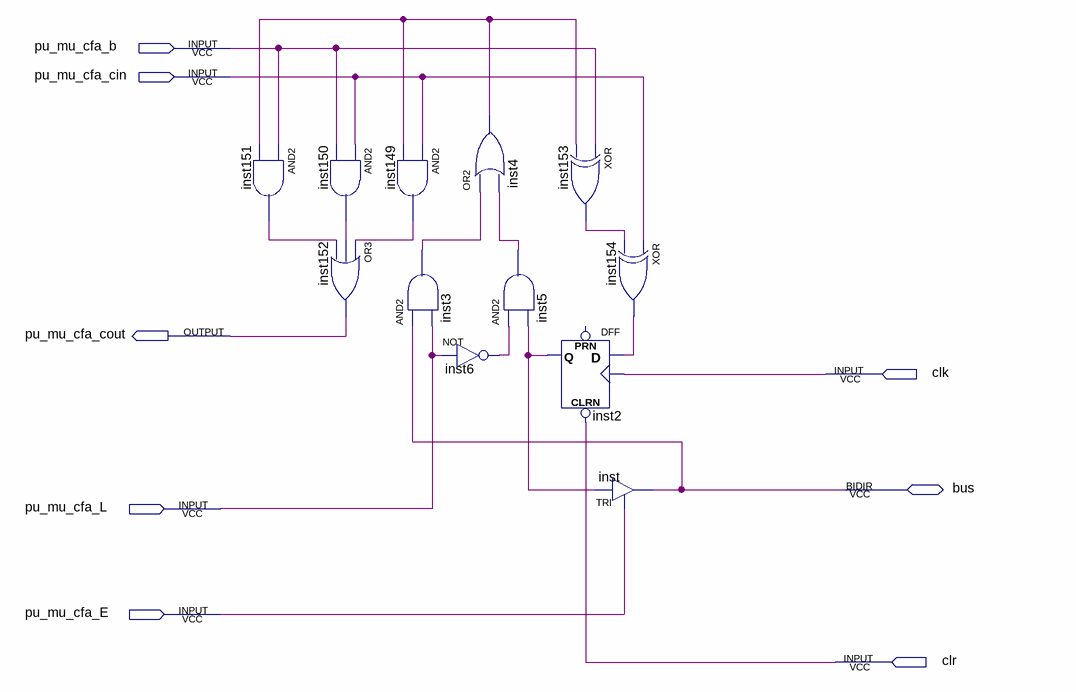
[diagram p0: schematic sheet]
// Quartus schematic cfa.bdf as structural Verilog: 12 symbols, 8 pins
module cfa (
  input  pu_mu_cfa_b,
  input  pu_mu_cfa_cin,
  input  clk,
  input  pu_mu_cfa_L,
  input  pu_mu_cfa_E,
  input  clr,
  inout  bus,
  output pu_mu_cfa_cout
);

  wire inst2_q, inst3_out, inst4_out, inst5_out, inst6_out, inst149_out, inst150_out, inst151_out,
       inst153_out, inst154_out;

  and inst151 (inst151_out, pu_mu_cfa_b, inst4_out);
  and inst150 (inst150_out, pu_mu_cfa_cin, pu_mu_cfa_b);
  or inst152 (pu_mu_cfa_cout, inst149_out, inst150_out, inst151_out);
  and inst149 (inst149_out, pu_mu_cfa_cin, inst4_out);
  and inst3 (inst3_out, bus, pu_mu_cfa_L);
  or inst4 (inst4_out, inst3_out, inst5_out);
  and inst5 (inst5_out, inst6_out, inst2_q);
  not inst6 (inst6_out, pu_mu_cfa_L);
  xor inst153 (inst153_out, pu_mu_cfa_b, inst4_out);
  DFF inst2 (.CLRN(clr), .CLK(clk), .D(inst154_out), .Q(inst2_q));  // open: PRN
  xor inst154 (inst154_out, pu_mu_cfa_cin, inst153_out);
  TRI inst (.IN(inst2_q), .OE(pu_mu_cfa_E), .OUT(bus));
endmodule
